# Altium project Smart-Car.PrjPcb
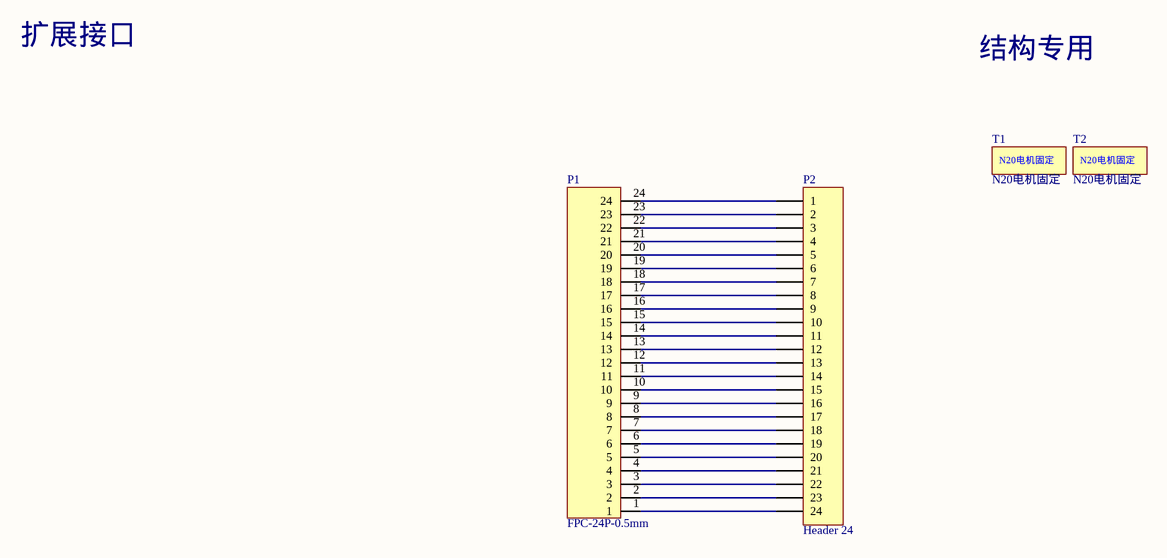
[diagram p0: Extend.SchDoc]
1 sheet, 4 parts. Net scope: global (net labels, ports and power ports of the same name join across sheets).
Board file: Smart-Car.PcbDoc

## Sheet Extend.SchDoc
size A4

### Parts
P1  FPC-24P-0.5mm  [FPC24-0.5mm]
P2  Header 24  [HDR1X24]
T1  N20电机固定  [MOTO]
T2  N20电机固定  [MOTO]

### Nets
NetP1_1: P1.1 P2.24
NetP1_2: P1.2 P2.23
NetP1_3: P1.3 P2.22
NetP1_4: P1.4 P2.21
NetP1_5: P1.5 P2.20
NetP1_6: P1.6 P2.19
NetP1_7: P1.7 P2.18
NetP1_8: P1.8 P2.17
NetP1_9: P1.9 P2.16
NetP1_10: P1.10 P2.15
NetP1_11: P1.11 P2.14
NetP1_12: P1.12 P2.13
NetP1_13: P1.13 P2.12
NetP1_14: P1.14 P2.11
NetP1_15: P1.15 P2.10
NetP1_16: P1.16 P2.9
NetP1_17: P1.17 P2.8
NetP1_18: P1.18 P2.7
NetP1_19: P1.19 P2.6
NetP1_20: P1.20 P2.5
NetP1_21: P1.21 P2.4
NetP1_22: P1.22 P2.3
NetP1_23: P1.23 P2.2
NetP1_24: P1.24 P2.1

### Notes on the sheet
- 扩展接口
- 结构专用

### Library data of the parts
P1 = FPC-24-0.5mm: 物料名称: FPC座; 物料编码: NA; 单位: PCS; 制造商: 深圳; 物料规格: FPC-24P-0.5mm; 物料型号: FPC-24P-0.5mm
P2 = Header 24: Header, 24-Pin; LatestRevisionDate: 17-Jul-2002; LatestRevisionNote: Re-released for DXP Platform.; Publisher: Altium Limited
T1 T2 = N20电机固定: 制造商: NA; 单位: PCS; 物料规格: N20电机固定; 物料名称: N20电机固定; 物料编码: NA; 物料型号: N20电机固定